# Altium project openbook.PrjPCB (part 4 of 4)

## Sheet p10_HDMI.SchDoc
size 386 x 246 mm
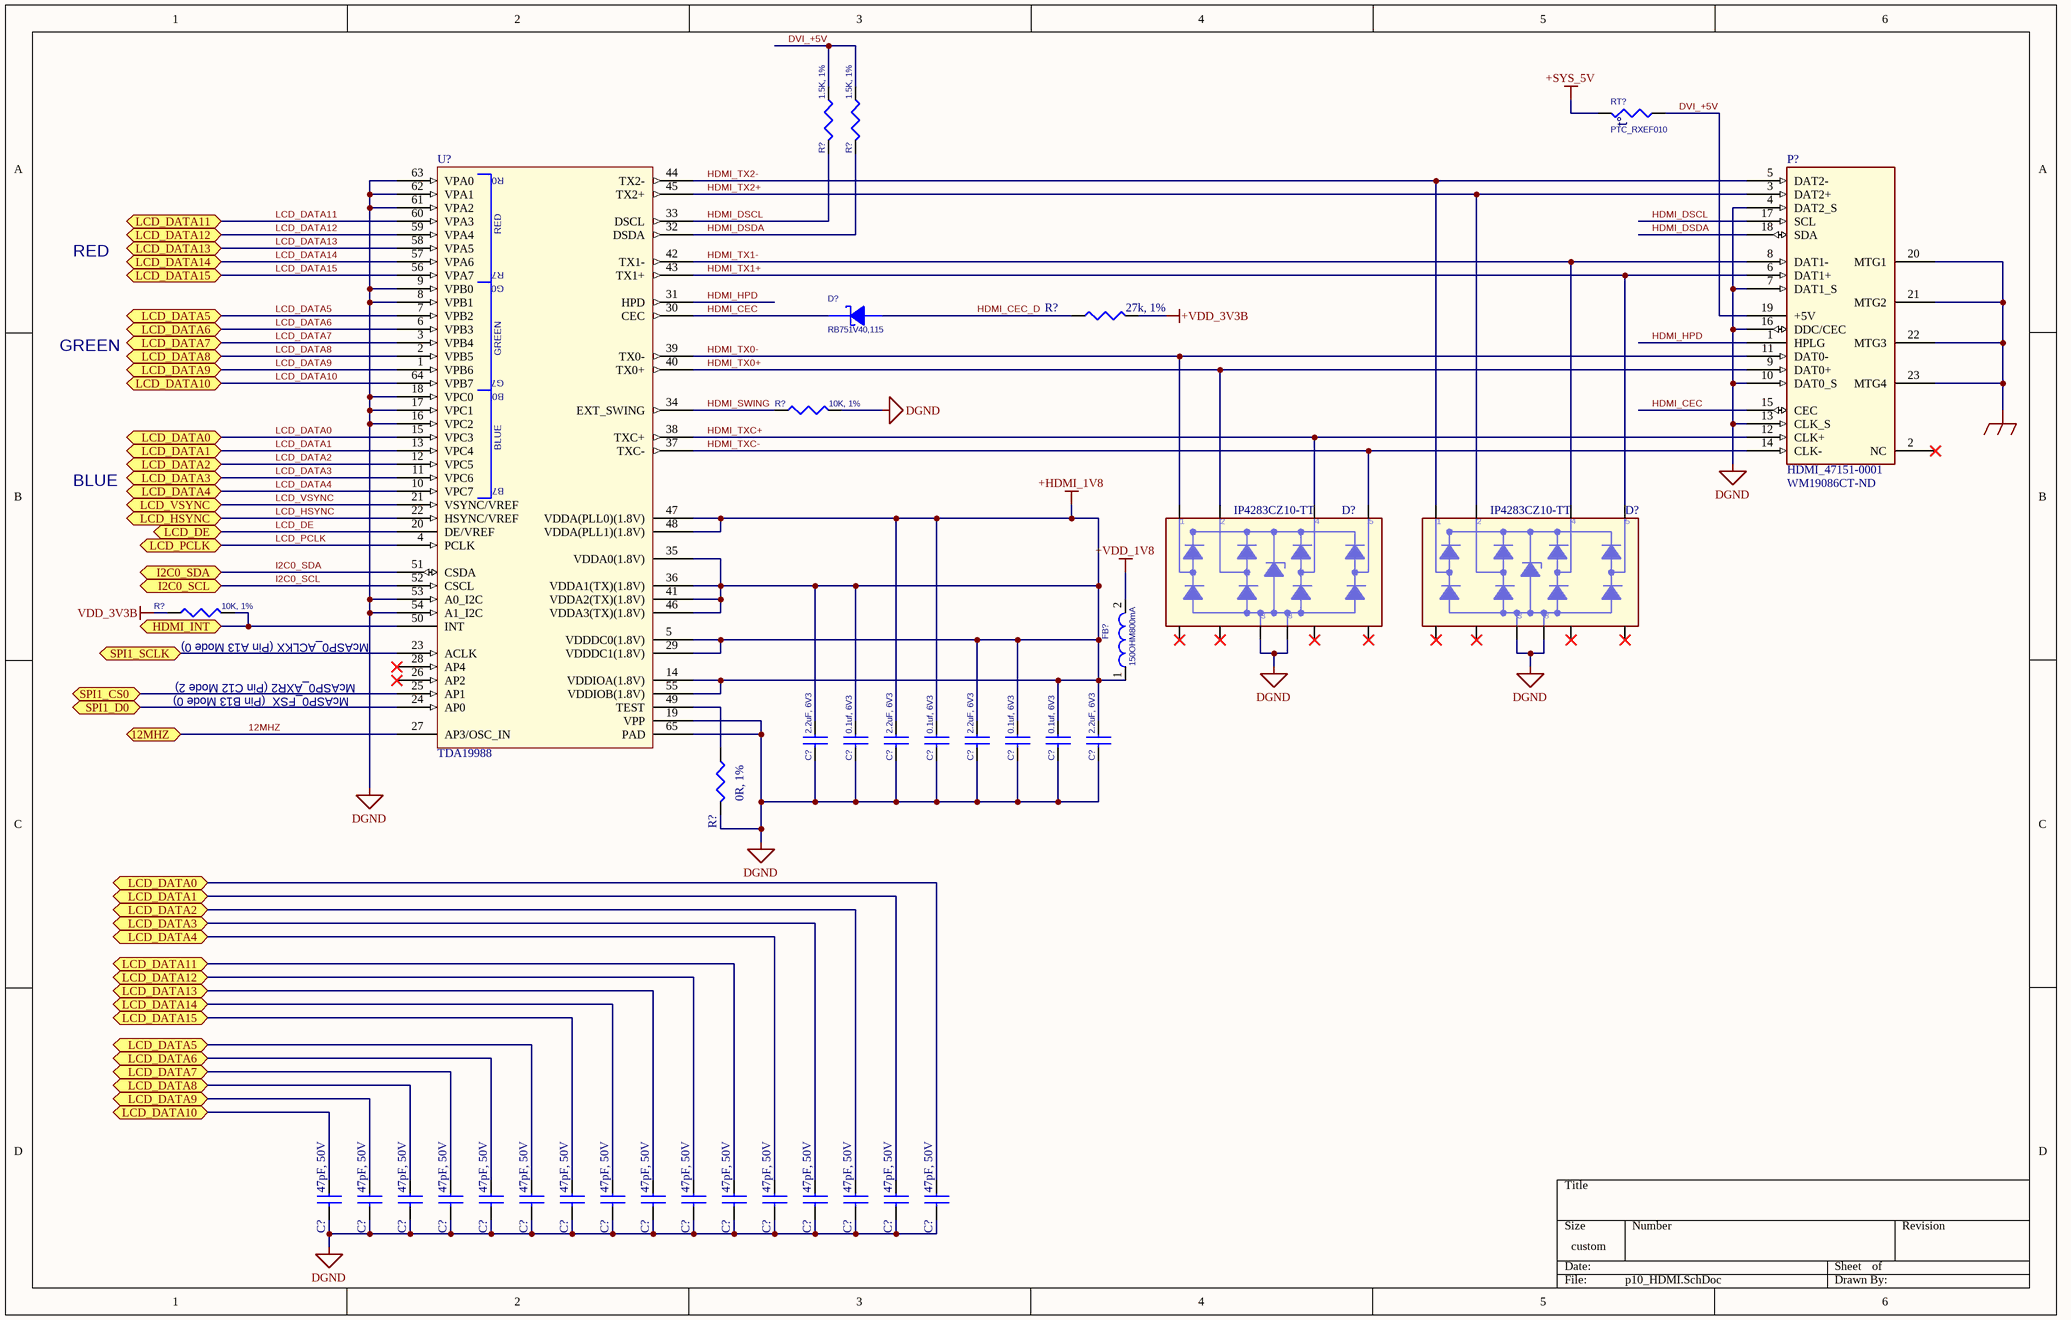
[diagram p10: p10_HDMI.SchDoc]

### Parts
(Parts that share a designator on the sheet are numbered #1, #2 ... from top to bottom, then left to right.)
C?#129  2.2uF, 6V3  [402]
C?#130  0.1uf, 6V3  [402]
C?#131  2.2uF, 6V3  [402]
C?#132  0.1uf, 6V3  [402]
C?#133  2.2uF, 6V3  [402]
C?#134  0.1uf, 6V3  [402]
C?#135  0.1uf, 6V3  [402]
C?#136  2.2uF, 6V3  [402]
C?#137  47pF, 50V  [402]
C?#138  47pF, 50V  [402]
C?#139  47pF, 50V  [402]
C?#140  47pF, 50V  [402]
C?#141  47pF, 50V  [402]
C?#142  47pF, 50V  [402]
C?#143  47pF, 50V  [402]
C?#144  47pF, 50V  [402]
C?#145  47pF, 50V  [402]
C?#146  47pF, 50V  [402]
C?#147  47pF, 50V  [402]
C?#148  47pF, 50V  [402]
C?#149  47pF, 50V  [402]
C?#150  47pF, 50V  [402]
C?#151  47pF, 50V  [402]
C?#152  47pF, 50V  [402]
D?#2  RB751V40,115  [SOD323]
D?#3  IP4283CZ10-TT  [TSSOP10]
D?#4  IP4283CZ10-TT  [TSSOP10]
FB?#8  150OHM800mA  [SM-7351-IND-0805]
P?#9  HDMI_47151-0001  Supplier Part Number 1: WM19086CT-ND  [HDMI]
R?#128  1.5K, 1%  [402]
R?#129  1.5K, 1%  [402]
R?#130  27k, 1%  [402]
R?#131  10K, 1%  [402]
R?#132  10K, 1%  [402]
R?#133  0R, 1%  [402]
RT?  PTC_RXEF010  [POLYSW200-5638-310]
U?#19  TDA19988  [QFN64S9X9P5]

### Ports
12MHZ, HDMI_INT, I2C0_SCL, I2C0_SDA, LCD_DATA0, LCD_DATA1, LCD_DATA2, LCD_DATA3, LCD_DATA4, LCD_DATA5, LCD_DATA6, LCD_DATA7, LCD_DATA8, LCD_DATA9, LCD_DATA10, LCD_DATA11, LCD_DATA12, LCD_DATA13, LCD_DATA14, LCD_DATA15, LCD_DE, LCD_HSYNC, LCD_PCLK, LCD_VSYNC, SPI1_CS0, SPI1_D0, SPI1_SCLK

### Nets
+HDMI_1V8: C?#129.1 C?#130.1 C?#131.1 C?#132.1 C?#133.1 C?#134.1 C?#135.1 C?#136.1 FB?#8.1 U?#19.5(VDDDC0(1.8V)) U?#19.14(VDDIOA(1.8V)) U?#19.29(VDDDC1(1.8V)) U?#19.35(VDDA0(1.8V)) U?#19.36(VDDA1(TX)(1.8V)) U?#19.41(VDDA2(TX)(1.8V)) U?#19.46(VDDA3(TX)(1.8V)) U?#19.47(VDDA(PLL0)(1.8V)) U?#19.48(VDDA(PLL1)(1.8V)) U?#19.55(VDDIOB(1.8V))
+SYS_5V: RT?.1(P1)
+VDD_1V8: FB?#8.2
+VDD_3V3B: R?#130.2
DGND: C?#129.2 C?#130.2 C?#131.2 C?#132.2 C?#133.2 C?#134.2 C?#135.2 C?#136.2 C?#137.2 C?#138.2 C?#139.2 C?#140.2 C?#141.2 C?#142.2 C?#143.2 C?#144.2 C?#145.2 C?#146.2 C?#147.2 C?#148.2 C?#149.2 C?#150.2 C?#151.2 C?#152.2 D?#3.3 D?#3.8 D?#4.3 D?#4.8 P?#9.4(DAT2_S) P?#9.7(DAT1_S) P?#9.10(DAT0_S) P?#9.13(CLK_S) P?#9.16(DDC/CEC) R?#131.2 R?#133.2 U?#19.8(VPB1) U?#19.9(VPB0) U?#19.16(VPC2) U?#19.17(VPC1) U?#19.18(VPC0) U?#19.19(VPP) U?#19.53(A0_I2C) U?#19.54(A1_I2C) U?#19.61(VPA2) U?#19.62(VPA1) U?#19.63(VPA0) U?#19.65(PAD)
GND_EARTH: P?#9.20(MTG1) P?#9.21(MTG2) P?#9.22(MTG3) P?#9.23(MTG4)
VDD_3V3B: R?#132.1
12MHZ: U?#19.27(AP3/OSC_IN) ; port 12MHZ
DVI_+5V: P?#9.19(+5V) R?#128.1 R?#129.1 RT?.2(P2)
HDMI_CEC: D?#2.1(C) P?#9.15(CEC) U?#19.30(CEC)
HDMI_CEC_D: D?#2.2(A) R?#130.1
HDMI_DSCL: P?#9.17(SCL) R?#128.2 U?#19.33(DSCL)
HDMI_DSDA: P?#9.18(SDA) R?#129.2 U?#19.32(DSDA)
HDMI_HPD: P?#9.1(HPLG) U?#19.31(HPD)
HDMI_SWING: R?#131.1 U?#19.34(EXT_SWING)
HDMI_TX0+: D?#3.2 P?#9.9(DAT0+) U?#19.40(TX0+)
HDMI_TX0-: D?#3.1 P?#9.11(DAT0-) U?#19.39(TX0-)
HDMI_TX1+: D?#4.5 P?#9.6(DAT1+) U?#19.43(TX1+)
HDMI_TX1-: D?#4.4 P?#9.8(DAT1-) U?#19.42(TX1-)
HDMI_TX2+: D?#4.2 P?#9.3(DAT2+) U?#19.45(TX2+)
HDMI_TX2-: D?#4.1 P?#9.5(DAT2-) U?#19.44(TX2-)
HDMI_TXC+: D?#3.4 P?#9.12(CLK+) U?#19.38(TXC+)
HDMI_TXC-: D?#3.5 P?#9.14(CLK-) U?#19.37(TXC-)
I2C0_SCL: U?#19.52(CSCL) ; port I2C0_SCL
I2C0_SDA: U?#19.51(CSDA) ; port I2C0_SDA  [project net I2C0_SCL]
LCD_DATA0: C?#152.1 U?#19.15(VPC3) ; port LCD_DATA0
LCD_DATA1: C?#151.1 U?#19.13(VPC4) ; port LCD_DATA1
LCD_DATA2: C?#150.1 U?#19.12(VPC5) ; port LCD_DATA2
LCD_DATA3: C?#149.1 U?#19.11(VPC6) ; port LCD_DATA3
LCD_DATA4: C?#148.1 U?#19.10(VPC7) ; port LCD_DATA4
LCD_DATA5: C?#142.1 U?#19.7(VPB2) ; port LCD_DATA5
LCD_DATA6: C?#141.1 U?#19.6(VPB3) ; port LCD_DATA6
LCD_DATA7: C?#140.1 U?#19.3(VPB4) ; port LCD_DATA7
LCD_DATA8: C?#139.1 U?#19.2(VPB5) ; port LCD_DATA8
LCD_DATA9: C?#138.1 U?#19.1(VPB6) ; port LCD_DATA9
LCD_DATA10: C?#137.1 U?#19.64(VPB7) ; port LCD_DATA10
LCD_DATA11: C?#147.1 U?#19.60(VPA3) ; port LCD_DATA11
LCD_DATA12: C?#146.1 U?#19.59(VPA4) ; port LCD_DATA12
LCD_DATA13: C?#145.1 U?#19.58(VPA5) ; port LCD_DATA13
LCD_DATA14: C?#144.1 U?#19.57(VPA6) ; port LCD_DATA14
LCD_DATA15: C?#143.1 U?#19.56(VPA7) ; port LCD_DATA15
LCD_DE: U?#19.20(DE/VREF) ; port LCD_DE
LCD_HSYNC: U?#19.22(HSYNC/VREF) ; port LCD_HSYNC
LCD_PCLK: U?#19.4(PCLK) ; port LCD_PCLK
LCD_VSYNC: U?#19.21(VSYNC/VREF) ; port LCD_VSYNC
SPI1_CS0: U?#19.25(AP1) ; port SPI1_CS0
SPI1_D0: U?#19.24(AP0) ; port SPI1_D0
SPI1_SCLK: U?#19.23(ACLK) ; port SPI1_SCLK
NetR?#132_2: R?#132.2 U?#19.50(INT) ; port HDMI_INT
NetR?#133_1: R?#133.1 U?#19.49(TEST)

Not connected (* = marked no-connect by the designer): D?#3 6* 7* 9* 10*; D?#4 6* 7* 9* 10*; P?#9 2(NC)*; U?#19 26(AP2)* 28(AP4)*

### Notes on the sheet
- RED
- GREEN
- BLUE
- (near R?#132) McASP0_ACLKX (Pin A13 Mode 0)
- McASP0_FSX  (Pin B13 Mode 0)
- McASP0_AXR2 (Pin C12 Mode 2)
- (in symbol PTC) t°
- (in symbol TDA19988) R0; RED; R7; G0; GREEN; G7; B0; BLUE; B7

### Library data of the parts
C?#129 C?#131 C?#133 C?#136 = CAP_2.2uF_X5R_6.3V_10%_0402: CAP CER 2.2UF 6.3V 10% X5R 0402; Manufacturer: TDK Corporation; Manufacturer Part Number: C1005X5R0J225K050BC; Capacitance: 2.2µF; Supplier 1: Digi-Key; Supplier Part Number 1: 445-6847-6-ND; RoHS: RoHS Compliant; Category: Capacitors; Stock 1: 47221; Pricing 1: 1=0.24, 10=0.2, 100=0.1, 250=0.075, 500=0.06626, 1000=0.05875, 5000=0.04875 (USD); Voltage - Rated: 6.3V; Tolerance: ±10%; Temperature Coefficient: X5R; Mounting Type: Surface Mount, MLCC; Operating Temperature: -55°C ~ 85°C; Applications: General Purpose; Ratings: -; Package / Case: 0402 (1005 Metric); Size / Dimension: 0.039" L x 0.020" W (1.00mm x 0.50mm); Height - Seated (Max): -; Thickness (Max): 0.022" (0.55mm); Lead Spacing: -; Features: -; Packaging: Digi-Reel®; Lead Style: -; ComponentLink1URL: http://product.tdk.com/capacitor/mlcc/en/documents/mlcc_commercial_general_en.pdf; ComponentLink1Description: http://product.tdk.com/capacitor/mlcc/en/documents/mlcc_commercial_general_en.pdf
C?#130 C?#132 C?#134 C?#135 = CAP_0.1uF_X7R_16V_10% 0402: CAP CER 0.1UF 6.3V 10% X5R 0402; Manufacturer: TDK Corporation; Manufacturer Part Number: C1005X5R0J104K050BA; Capacitance: 0.1µF; Applications: General Purpose; Category: Capacitors; ComponentLink1Description: http://www.kemet.com/datasheets&C0402C104K4RACTU; ComponentLink1URL: http://www.kemet.com/datasheets&C0402C104K4RACTU; Features: -; Height - Seated (Max): -; Lead Spacing: -; Lead Style: -; Mounting Type: Surface Mount, MLCC; Operating Temperature: -55°C ~ 85°C; Package / Case: 0402 (1005 Metric); Packaging: Digi-Reel®; Pricing 1: 1=0.1, 10=0.026, 100=0.0121, 250=0.00992, 500=0.00848, 1000=0.0066, 5000=0.0055 (USD); Ratings: -; RoHS: RoHS Compliant; Size / Dimension: 0.039" L x 0.020" W (1.00mm x 0.50mm); Stock 1: 127604; Supplier 1: Digi-Key; Supplier Part Number 1: 445-1266-6-ND; Temperature Coefficient: X5R; Thickness (Max): 0.022" (0.55mm); Tolerance: ±10%; Voltage - Rated: 6.3V
C?#137-C?#152 = CAP_47PF_COG_50V_5%_0402: CAP CER 47PF 50V 5% NP0 0402; Manufacturer: TDK Corporation; Manufacturer Part Number: C1005C0G1H470J050BA; Temperature Coefficient: C0G, NP0; Supplier 1: Digi-Key; RoHS: RoHS Compliant; Category: Capacitors; Stock 1: 596222; Pricing 1: 1=0.1, 10=0.024, 100=0.011, 250=0.009, 500=0.0077, 1000=0.006, 5000=0.005 (USD); Packaging: Cut Tape (CT); Capacitance: 47pF; Voltage - Rated: 50V; Tolerance: ±5%; Mounting Type: Surface Mount, MLCC; Operating Temperature: -55°C ~ 125°C; Applications: General Purpose; Ratings: -; Package/Case: 0402 (1005 Metric); Size / Dimension: 0.039" L x 0.020" W (1.00mm x 0.50mm); Height - Seated (Max): -; Thickness (Max): 0.022" (0.55mm); Lead Spacing: -; Features: -; Lead Style: -; ComponentLink1URL: http://product.tdk.com/capacitor/mlcc/en/documents/mlcc_commercial_general_en.pdf; ComponentLink1Description: http://product.tdk.com/capacitor/mlcc/en/documents/mlcc_commercial_general_en.pdf; Supplier Part Number 1: 445-1243-1-ND
D?#2 = Zener: DIODE SCHOTTKY 40V 120MA SOD323; Manufacturer: NXP Semiconductors; Current - Average Rectified (Io): 120mA (DC); Voltage - Forward (Vf) (Max) @ If: 370mV @ 1mA; Speed: Small Signal =< 200mA (Io), Any Speed; Current - Reverse Leakage @ Vr: 500nA @ 30V; Capacitance @ Vr, F: 2pF @ 1V, 1MHz; Supplier 1: Digi-Key; Supplier Part Number 1: 568-8119-6-ND; Manufacturer Part Number: RB751V40,115; RoHS: RoHS Compliant; Category: Discrete Semiconductor Products; Stock 1: 5326; Pricing 1: 1=0.29, 10=0.26, 25=0.1872, 100=0.1456, 250=0.09152, 500=0.07798, 1000=0.05313 (USD); Diode Type: Schottky; Voltage - DC Reverse (Vr) (Max): 40V; Reverse Recovery Time (trr): -; Mounting Type: Surface Mount; Package / Case: SC-76, SOD-323; Supplier Device Package: SOD-323; Packaging: Digi-Reel®; ComponentLink1URL: http://www.nxp.com/documents/data_sheet/RB751_SER.pdf; ComponentLink1Description: http://www.nxp.com/documents/data_sheet/RB751_SER.pdf
D?#3 D?#4 = 32CTQ030/TO_1: DIODE ESD PROT HDMI 10TSSOP; Manufacturer: NXP Semiconductors; Manufacturer Part Number: IP4283CZ10-TT,118; Voltage - Reverse Standoff (Typ): 3V; Voltage - Breakdown: 6V; Polarization: 4 Channel Array - Unidirectional; Supplier 1: Digi-Key; Supplier Part Number 1: 568-5875-6-ND; RoHS: RoHS Compliant; Category: Circuit Protection; Stock 1: 1067; Pricing 1: 1=0.85, 10=0.743, 25=0.6568, 100=0.5724, 250=0.49828, 500=0.42416, 1000=0.33974 (USD); Power (Watts): -; Mounting Type: Surface Mount; Package / Case: 10-TFSOP, 10-MSOP (0.118", 3.00mm Width); Supplier Device Package: 10-TSSOP; Packaging: Digi-Reel®; ComponentLink1URL: http://media.digikey.com/pdf/Data%20Sheets/NXP%20PDFs/IP4283CZ10.pdf; ComponentLink1Description: http://media.digikey.com/pdf/Data%20Sheets/NXP%20PDFs/IP4283CZ10.pdf
FB?#8 = IND: FERRITE 800MA 150 OHM 0805 SMD; Manufacturer: Laird-Signal Integrity Products; Manufacturer Part Number: LI0805H151R-10; Impedance @ Frequency: 150 Ohm @ 100MHz; DC Resistance (DCR): 150 mOhm Max; Filter Type: Differential Mode - Single; Supplier 1: Digi-Key; Supplier Part Number 1: 240-2384-6-ND; RoHS: RoHS Compliant; Category: Filters; Stock 1: 10144; Pricing 1: 1=0.1, 10=0.07, 25=0.064, 50=0.0574, 100=0.0421, 250=0.03064, 500=0.02808, 1000=0.02424 (USD); Current Rating: 800mA; Package / Case: 0805 (2012 Metric); Mounting Type: Surface Mount; Packaging: Digi-Reel®; Height (Max): 0.043" (1.10mm); Size / Dimension: 0.079" L x 0.049" W (2.00mm x 1.25mm); ComponentLink1URL: http://www.lairdtech.com/WorkArea/linkit.aspx?LinkIdentifier=id&ItemID=4912; ComponentLink1Description: http://www.lairdtech.com/WorkArea/linkit.aspx?LinkIdentifier=id&ItemID=4912
P?#9 = HDMI_47151-0001: CONN RCPT 19POS HDMI RT ANG SMD; Manufacturer: Molex Inc; Manufacturer Part Number: 0471510001; Number of Contacts: 19; Gender: Receptacle; Supplier 1: Digi-Key; RoHS: RoHS Compliant; Category: Connectors, Interconnects; Stock 1: 6388; Pricing 1: 1=2.57, 10=2.332, 25=2.1888, 50=2.0938, 100=1.9986 (USD); Packaging: Cut Tape (CT); Connector Type: HDMI; Specifications: -; Mounting Type: Surface Mount, Right Angle, Horizontal; Features: Detent Lock; Ingress Protection: -; ComponentLink1URL: http://www.molex.com/pdm_docs/sd/471510001_sd.pdf; ComponentLink1Description: http://www.molex.com/pdm_docs/sd/471510001_sd.pdf
R?#128 R?#129 = RES_1.5K_1/16W_5%_0402: RES 1.50K OHM 1/16W 1% 0402 SMD; Manufacturer: Yageo; Manufacturer Part Number: RC0402FR-071K5L; Power (Watts): 0.063W, 1/16W; Temperature Coefficient: ±100ppm/°C; Supplier 1: Digi-Key; Supplier Part Number 1: 311-1.50KLRDKR-ND; RoHS: RoHS Compliant; Category: Resistors; Stock 1: 465266; Pricing 1: 1=0.1, 10=0.014, 25=0.0104, 100=0.0063, 250=0.0054, 500=0.00382, 1000=0.0027, 2500=0.00234, 5000=0.00203 (USD); Resistance (Ohms): 1.5k; Composition: Thick Film; Features: -; Tolerance: ±1%; Package / Case: 0402 (1005 Metric); Supplier Device Package: 0402; Size / Dimension: 0.039" L x 0.020" W (1.00mm x 0.50mm); Height: 0.016" (0.40mm); Number of Terminations: 2; Packaging: Digi-Reel®; ComponentLink1URL: http://www.yageo.com/documents/recent/PYu-RC0402_51_RoHS_L_6.pdf; ComponentLink1Description: http://www.yageo.com/documents/recent/PYu-RC0402_51_RoHS_L_6.pdf
R?#130 = RES_27K_1/16W_1%_0402: RES 27K OHM 1/16W 1% 0402 SMD; Manufacturer: Yageo; Manufacturer Part Number: RC0402FR-0727KL; Power (Watts): 0.063W, 1/16W; Temperature Coefficient: ±100ppm/°C; Supplier 1: Digi-Key; RoHS: RoHS Compliant; Category: Resistors; Stock 1: 270424; Pricing 1: 1=0.1, 10=0.014, 25=0.0104, 100=0.0063, 250=0.0054, 500=0.00382, 1000=0.0027, 2500=0.00234, 5000=0.00203 (USD); Packaging: Cut Tape (CT); Resistance (Ohms): 27k; Tolerance: ±1%; Composition: Thick Film; Features: -; Package/Case: 0402 (1005 Metric); Supplier Device Package: 0402; Size / Dimension: 0.039" L x 0.020" W (1.00mm x 0.50mm); Height: 0.016" (0.40mm); Number of Terminations: 2; ComponentLink1URL: http://www.yageo.com/documents/recent/PYu-RC0402_51_RoHS_L_6.pdf; ComponentLink1Description: http://www.yageo.com/documents/recent/PYu-RC0402_51_RoHS_L_6.pdf; Supplier Part Number 1: 311-27.0KLRCT-ND
R?#131 R?#132 = RES_10K_1/16W_1%_0402: RES 10K OHM 1/16W 5% 0402 SMD; Manufacturer: Rohm Semiconductor; Manufacturer Part Number: MCR01MZPJ103; Power (Watts): 0.063W, 1/16W; Temperature Coefficient: ±200ppm/°C; Supplier 1: Digi-Key; Supplier Part Number 1: RHM10KJDKR-ND; RoHS: RoHS Compliant; Category: Resistors; Stock 1: 110842; Pricing 1: 1=0.1, 10=0.019, 25=0.014, 100=0.0078, 250=0.00596, 500=0.00476, 1000=0.0035, 5000=0.00251 (USD); Resistance (Ohms): 10k; Composition: Thick Film; Features: Automotive AEC-Q200 Qualified; Tolerance: ±5%; Package / Case: 0402 (1005 Metric); Supplier Device Package: 0402 (1005 Metric); Size / Dimension: 0.039" L x 0.020" W (1.00mm x 0.50mm); Height: 0.016" (0.40mm); Number of Terminations: 2; Packaging: Digi-Reel®; ComponentLink1URL: http://rohmfs.rohm.com/en/products/databook/datasheet/passive/resistor/chip_resistor/mcr_a.pdf; ComponentLink1Description: http://rohmfs.rohm.com/en/products/databook/datasheet/passive/resistor/chip_resistor/mcr_a.pdf
R?#133 = RES_0_1/16W_1%_0402: RES 0.0 OHM 1/16W 0402 SMD; Manufacturer: Yageo; Manufacturer Part Number: RC0402JR-070RL; Power (Watts): 0.063W, 1/16W; Resistance (Ohms): 0.0; Tolerance: Jumper; Category: Resistors; ComponentLink1Description: http://www.yageo.com/documents/recent/PYu-RC0402_51_RoHS_L_6.pdf; ComponentLink1URL: http://www.yageo.com/documents/recent/PYu-RC0402_51_RoHS_L_6.pdf; Composition: Thick Film; Features: -; Height: 0.016" (0.40mm); Number of Terminations: 2; Package / Case: 0402 (1005 Metric); Packaging: Digi-Reel®; Pricing 1: 1=0.1, 10=0.012, 25=0.0092, 100=0.0055, 250=0.00476, 500=0.00336, 1000=0.00237, 2500=0.00206, 5000=0.00178 (USD); RoHS: RoHS Compliant; Size / Dimension: 0.039" L x 0.020" W (1.00mm x 0.50mm); Stock 1: 4904429; Supplier 1: Digi-Key; Supplier Device Package: 0402; Supplier Part Number 1: 311-0.0JRDKR-ND; Temperature Coefficient: -
RT? = PTC: POLYSWITCH PTC RESET 0.1A; Manufacturer: TE Connectivity; Current - Hold (Ih) (Max): 100mA; Current - Trip (It): 200mA; Current - Max: 40A; Voltage - Max: 60V; R Min/Max: 2.500 ~ 4.500 Ohm; Time to Trip: 4s; Supplier 1: Digi-Key; Supplier Part Number 1: RXEF010-ND; Manufacturer Part Number: RXEF010; RoHS: RoHS Compliant; Category: Circuit Protection; Stock 1: 22325; Pricing 1: 1=0.32, 10=0.289, 100=0.2625, 500=0.20476, 1000=0.1764, 5000=0.1617, 10000=0.1365, 50000=0.13125, 100000=0.126 (USD); Package / Case: Radial, Disc; Packaging: Bulk; ComponentLink1URL: http://documents.tycoelectronics.com/commerce/DocumentDelivery/DDEController?Action=showdoc&DocId=Specification+Or+Standard%7FSCD25213%7FE%7Fpdf%7FEnglish%7FENG_SS_SCD25213_E.pdf; ComponentLink1Description: http://documents.tycoelectronics.com/commerce/DocumentDelivery/DDEController?Action=showdoc&DocId=Specification+Or+Standard%7FSCD25213%7FE%7Fpdf%7FEnglish%7FENG_SS_SCD25213_E.pdf
U?#19 = TDA19988: IC HDMI TRANSMITTER 64-HVQFN; Manufacturer: NXP Semiconductors; Manufacturer Part Number: TDA19988AHN/C1,551; Supplier 1: Digi-Key; Supplier Part Number 1: TDA19988AHN/C1,551-ND; RoHS: RoHS Compliant; Category: Integrated Circuits (ICs); Stock 1: 0; Pricing 1: 260=4.59 (USD); Type: HDMI Transmitter; Applications: Set-Top Boxes; Mounting Type: Surface Mount; Package / Case: 64-VFQFN Exposed Pad; Supplier Device Package: 64-HVQFN (9x9); Packaging: Tray

## Sheet p11_LVDS.SchDoc
size 386 x 246 mm
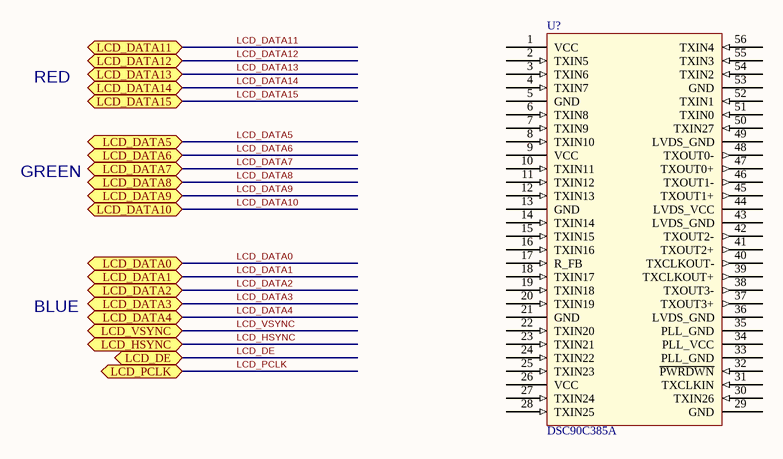
[diagram p11: p11_LVDS.SchDoc]

### Parts
(Parts that share a designator on the sheet are numbered #1, #2 ... from top to bottom, then left to right.)
U?#20  DSC90C385A  [TSSOP56]

### Ports
LCD_DATA0, LCD_DATA1, LCD_DATA2, LCD_DATA3, LCD_DATA4, LCD_DATA5, LCD_DATA6, LCD_DATA7, LCD_DATA8, LCD_DATA9, LCD_DATA10, LCD_DATA11, LCD_DATA12, LCD_DATA13, LCD_DATA14, LCD_DATA15, LCD_DE, LCD_HSYNC, LCD_PCLK, LCD_VSYNC

### Nets

Not connected (* = marked no-connect by the designer): U?#20 1(VCC) 2(TXIN5) 3(TXIN6) 4(TXIN7) 5(GND) 6(TXIN8) 7(TXIN9) 8(TXIN10) 9(VCC) 10(TXIN11) 11(TXIN12) 12(TXIN13) 13(GND) 14(TXIN14) 15(TXIN15) 16(TXIN16) 17(R_FB) 18(TXIN17) 19(TXIN18) 20(TXIN19) 21(GND) 22(TXIN20) 23(TXIN21) 24(TXIN22) 25(TXIN23) 26(VCC) 27(TXIN24) 28(TXIN25) 29(GND) 30(TXIN26) 31(TXCLKIN) 32(~{PWRDWN}) 33(PLL_GND) 34(PLL_VCC) 35(PLL_GND) 36(LVDS_GND) 37(TXOUT3+) 38(TXOUT3-) 39(TXCLKOUT+) 40(TXCLKOUT-) 41(TXOUT2+) 42(TXOUT2-) 43(LVDS_GND) 44(LVDS_VCC) 45(TXOUT1+) 46(TXOUT1-) 47(TXOUT0+) 48(TXOUT0-) 49(LVDS_GND) 50(TXIN27) 51(TXIN0) 52(TXIN1) 53(GND) 54(TXIN2) 55(TXIN3) 56(TXIN4)

### Notes on the sheet
- RED
- GREEN
- BLUE

### Library data of the parts
U?#20 = DS90C385A: IC TX LVDS FPD 24BIT 56TSSOP; Manufacturer: Texas Instruments; Manufacturer Part Number: DS90C385AMTX/NOPB; Protocol: FPD-Link, LVDS; Number of Drivers/Receivers: 5/0; Data Rate: 2.45Gbps; Voltage - Supply: 3 V ~ 3.6 V; Supplier 1: Digi-Key; RoHS: RoHS Compliant; Category: Integrated Circuits (ICs); Stock 1: 2071; Pricing 1: 1=4.92, 10=4.412, 25=3.9672, 100=2.3085, 250=2.26576, 500=2.223 (USD); Packaging: Cut Tape (CT); Type: Driver; Duplex: -; Receiver Hysteresis: -; Operating Temperature: -10°C ~ 70°C; Mounting Type: Surface Mount; Package / Case: 56-TFSOP (0.240", 6.10mm Width); Supplier Device Package: 56-TSSOP; ComponentLink1URL: http://www.ti.com/lit/ds/symlink/ds90c385a.pdf; ComponentLink1Description: http://www.ti.com/lit/ds/symlink/ds90c385a.pdf; Supplier Part Number 1: DS90C385AMTX/NOPBCT-ND

## Sheet p12_trackpad_keyboard.SchDoc
size A

## Sheet p13_SD.SchDoc
size 386 x 246 mm
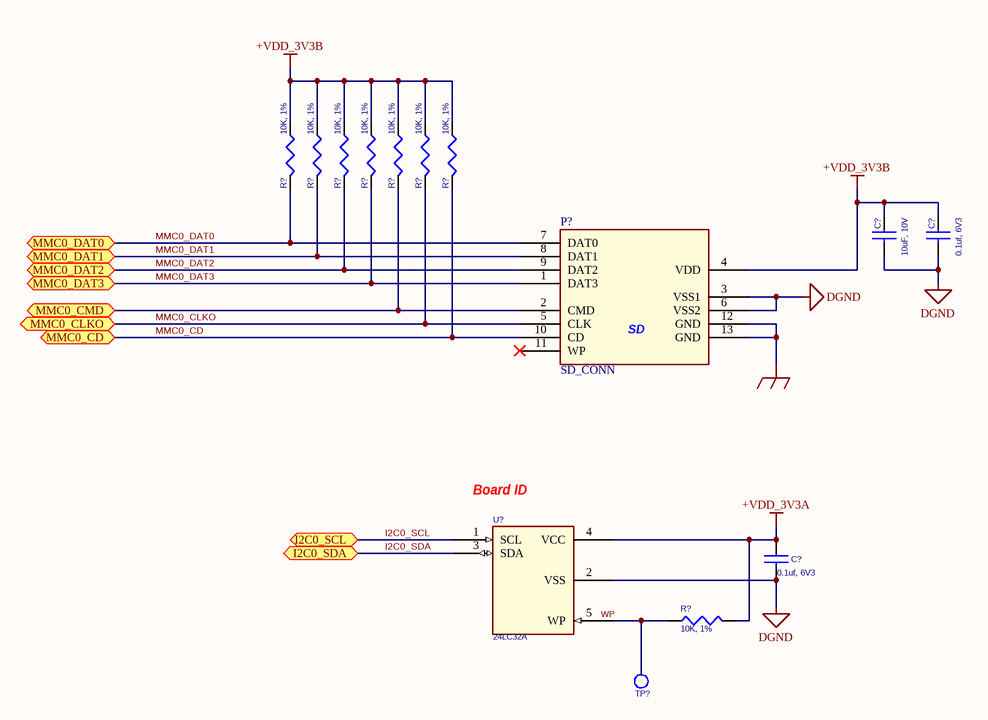
[diagram p12: p13_SD.SchDoc]

### Parts
(Parts that share a designator on the sheet are numbered #1, #2 ... from top to bottom, then left to right.)
C?#153  10uF, 10V  [805]
C?#154  0.1uf, 6V3  [402]
C?#155  0.1uf, 6V3  [402]
P?#10  SD_CONN  [SD-CONN]
R?#134  10K, 1%  [402]
R?#135  10K, 1%  [402]
R?#136  10K, 1%  [402]
R?#137  10K, 1%  [402]
R?#138  10K, 1%  [402]
R?#139  10K, 1%  [402]
R?#140  10K, 1%  [402]
R?#141  10K, 1%  [402]
TP?  TESTPT1  [tp1-8040]  (value not drawn)  (no BOM)
U?#21  24LC32A  [SOT23-5]

### Ports
I2C0_SCL, I2C0_SDA, MMC0_CD, MMC0_CLKO, MMC0_CMD, MMC0_DAT0, MMC0_DAT1, MMC0_DAT2, MMC0_DAT3

### Nets
+VDD_3V3A: C?#155.1 R?#141.2 U?#21.4(VCC)
+VDD_3V3B: C?#153.1 C?#154.1 P?#10.4(VDD) R?#134.1 R?#135.1 R?#136.1 R?#137.1 R?#138.1 R?#139.1 R?#140.1
DGND: C?#153.2 C?#154.2 C?#155.2 P?#10.3(VSS1) P?#10.6(VSS2) U?#21.2(VSS)
GND_EARTH: P?#10.12(GND) P?#10.13(GND)
I2C0_SCL: U?#21.1(SCL) ; port I2C0_SCL
I2C0_SDA: U?#21.3(SDA) ; port I2C0_SDA  [project net I2C0_SCL]
MMC0_CD: P?#10.10(CD) R?#140.2 ; port MMC0_CD
MMC0_CLKO: P?#10.5(CLK) R?#139.2 ; port MMC0_CLKO
MMC0_CMD: P?#10.2(CMD) R?#138.2 ; port MMC0_CMD
MMC0_DAT0: P?#10.7(DAT0) R?#134.2 ; port MMC0_DAT0
MMC0_DAT1: P?#10.8(DAT1) R?#135.2 ; port MMC0_DAT1
MMC0_DAT2: P?#10.9(DAT2) R?#136.2 ; port MMC0_DAT2
MMC0_DAT3: P?#10.1(DAT3) R?#137.2 ; port MMC0_DAT3
NetR?#141_1: R?#141.1 U?#21.5(WP)

Not connected (* = marked no-connect by the designer): P?#10 11(WP)*; TP? 1(TP)

### Notes on the sheet
- (near U?#21) Board ID
- Labels drawn without touching a wire or pin: WP
- (in symbol SD_CONN) SD

### Library data of the parts
C?#153 = CAP_10uF_Y5V_10V_10%_0805: CAP CER 10UF 10V Y5V 0805; Manufacturer: TDK Corporation; Manufacturer Part Number: C2012Y5V1A106Z; Capacitance: 10µF; Tolerance: -20%, +80%; Temperature Coefficient: Y5V (F); Supplier 1: Digi-Key; Supplier Part Number 1: 445-1371-6-ND; RoHS: RoHS Compliant; Category: Capacitors; Stock 1: 123307; Pricing 1: 1=0.15, 10=0.105, 100=0.0499, 250=0.042, 500=0.03518, 1000=0.02887 (USD); Voltage - Rated: 10V; Mounting Type: Surface Mount, MLCC; Operating Temperature: -30°C ~ 85°C; Applications: General Purpose; Ratings: -; Package / Case: 0805 (2012 Metric); Size / Dimension: 0.079" L x 0.049" W (2.00mm x 1.25mm); Height - Seated (Max): -; Thickness (Max): 0.057" (1.45mm); Lead Spacing: -; Features: -; Packaging: Digi-Reel®; Lead Style: -; ComponentLink1URL: http://media.digikey.com/pdf/Data%20Sheets/TDK%20PDFs/C_Series_GeneralAppl_B11.pdf; ComponentLink1Description: http://media.digikey.com/pdf/Data%20Sheets/TDK%20PDFs/C_Series_GeneralAppl_B11.pdf
C?#154 C?#155 = CAP_0.1uF_X7R_16V_10% 0402: as C?#130 on sheet p10_HDMI; Applications: General Purpose; Category: Capacitors; ComponentLink1Description: http://www.kemet.com/datasheets&C0402C104K4RACTU; ComponentLink1URL: http://www.kemet.com/datasheets&C0402C104K4RACTU; Features: -; Height - Seated (Max): -; Lead Spacing: -; Lead Style: -; Mounting Type: Surface Mount, MLCC; Operating Temperature: -55°C ~ 85°C; Package / Case: 0402 (1005 Metric); Packaging: Digi-Reel®; Pricing 1: 1=0.1, 10=0.026, 100=0.0121, 250=0.00992, 500=0.00848, 1000=0.0066, 5000=0.0055 (USD); Ratings: -; RoHS: RoHS Compliant; Size / Dimension: 0.039" L x 0.020" W (1.00mm x 0.50mm); Stock 1: 127604; Supplier 1: Digi-Key; Supplier Part Number 1: 445-1266-6-ND; Temperature Coefficient: X5R; Thickness (Max): 0.022" (0.55mm); Tolerance: ±10%; Voltage - Rated: 6.3V
P?#10 = SD_CONN: CONNECTOR SD 9POS PUSH PUSH; Manufacturer: Amphenol Commercial Products; Manufacturer Part Number: 101-00313-68-02; Card Type: Secure Digital - SD; Number of Positions: 9; Connector Type: Connector and Ejector; Insertion, Removal Method: Push In, Push Out; Supplier 1: Digi-Key; RoHS: RoHS Compliant; Category: Connectors, Interconnects; Stock 1: 8816; Pricing 1: 1=2.19, 10=1.989, 25=1.8672, 50=1.786, 100=1.7048 (USD); Packaging: Cut Tape (CT); Ejector Side: -; Mounting Type: Surface Mount, Right Angle; Features: Board Guide; Height Above Board: 0.106" (2.70mm); Mounting Feature: Normal, Standard - Top; Contact Finish: Gold; Contact Finish Thickness: 15µin (0.38µm); ComponentLink1URL: http://media.digikey.com/pdf/Data%20Sheets/Amphenol%20PDFs/101-00313.pdf; ComponentLink1Description: http://media.digikey.com/pdf/Data%20Sheets/Amphenol%20PDFs/101-00313.pdf; Supplier Part Number 1: 101-00313-68-02CT-ND
R?#134-R?#141 = RES_10K_1/16W_1%_0402: as R?#131 on sheet p10_HDMI; Supplier 1: Digi-Key; Supplier Part Number 1: RHM10KJDKR-ND; RoHS: RoHS Compliant; Category: Resistors; Stock 1: 110842; Pricing 1: 1=0.1, 10=0.019, 25=0.014, 100=0.0078, 250=0.00596, 500=0.00476, 1000=0.0035, 5000=0.00251 (USD); Resistance (Ohms): 10k; Composition: Thick Film; Features: Automotive AEC-Q200 Qualified; Tolerance: ±5%; Package / Case: 0402 (1005 Metric); Supplier Device Package: 0402 (1005 Metric); Size / Dimension: 0.039" L x 0.020" W (1.00mm x 0.50mm); Height: 0.016" (0.40mm); Number of Terminations: 2; Packaging: Digi-Reel®; ComponentLink1URL: http://rohmfs.rohm.com/en/products/databook/datasheet/passive/resistor/chip_resistor/mcr_a.pdf; ComponentLink1Description: http://rohmfs.rohm.com/en/products/databook/datasheet/passive/resistor/chip_resistor/mcr_a.pdf
U?#21 = 24LC32A: IC EEPROM 32KBIT 400KHZ SOT23-5; Manufacturer: Microchip Technology; Manufacturer Part Number: 24LC32AT-I/OT; Format - Memory: EEPROMs - Serial; Memory Size: 32K (4K x 8); Interface: I²C, 2-Wire Serial; Voltage - Supply: 2.5 V ~ 5.5 V; Supplier 1: Digi-Key; Supplier Part Number 1: 24LC32AT-I/OTDKR-ND; RoHS: RoHS Compliant; Category: Integrated Circuits (ICs); Stock 1: 8694; Pricing 1: 1=0.5, 10=0.32, 25=0.31, 100=0.3 (USD); Memory Type: EEPROM; Speed: 400kHz; Operating Temperature: -40°C ~ 85°C; Package / Case: SC-74A, SOT-753; Supplier Device Package: SOT-23-5; Packaging: Digi-Reel®; ComponentLink1URL: http://ww1.microchip.com/downloads/en/DeviceDoc/21713M.pdf; ComponentLink1Description: http://ww1.microchip.com/downloads/en/DeviceDoc/21713M.pdf

## Sheet p14_WiFi_RAK310.SchDoc
size 386 x 246 mm
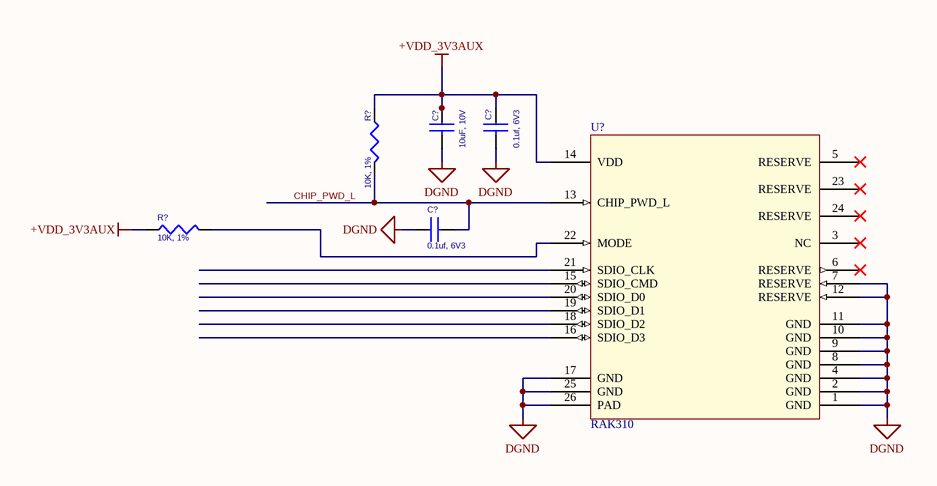
[diagram p13: p14_WiFi_RAK310.SchDoc]

### Parts
(Parts that share a designator on the sheet are numbered #1, #2 ... from top to bottom, then left to right.)
C?#156  10uF, 10V  [805]
C?#157  0.1uf, 6V3  [402]
C?#158  0.1uf, 6V3  [402]
R?#142  10K, 1%  [402]
R?#143  10K, 1%  [402]
U?#22  RAK310  [RAK310_MOD]

### Nets
+VDD_3V3AUX: C?#156.1 C?#157.1 R?#142.1 R?#143.1 U?#22.14(VDD)
DGND: C?#156.2 C?#157.2 C?#158.1 U?#22.1(GND) U?#22.2(GND) U?#22.4(GND) U?#22.7(RESERVE) U?#22.8(GND) U?#22.9(GND) U?#22.10(GND) U?#22.11(GND) U?#22.12(RESERVE) U?#22.17(GND) U?#22.25(GND) U?#22.26(PAD)
CHIP_PWD_L: C?#158.2 R?#142.2 U?#22.13(CHIP_PWD_L)
NetR?#143_2: R?#143.2 U?#22.22(MODE)

Not connected (* = marked no-connect by the designer): U?#22 3(NC)* 5(RESERVE)* 6(RESERVE)* 15(SDIO_CMD) 16(SDIO_D3) 18(SDIO_D2) 19(SDIO_D1) 20(SDIO_D0) 21(SDIO_CLK) 23(RESERVE)* 24(RESERVE)*

### Library data of the parts
C?#156 = CAP_10uF_Y5V_10V_10%_0805: as C?#153 on sheet p13_SD; Supplier 1: Digi-Key; Supplier Part Number 1: 445-1371-6-ND; RoHS: RoHS Compliant; Category: Capacitors; Stock 1: 123307; Pricing 1: 1=0.15, 10=0.105, 100=0.0499, 250=0.042, 500=0.03518, 1000=0.02887 (USD); Voltage - Rated: 10V; Mounting Type: Surface Mount, MLCC; Operating Temperature: -30°C ~ 85°C; Applications: General Purpose; Ratings: -; Package / Case: 0805 (2012 Metric); Size / Dimension: 0.079" L x 0.049" W (2.00mm x 1.25mm); Height - Seated (Max): -; Thickness (Max): 0.057" (1.45mm); Lead Spacing: -; Features: -; Packaging: Digi-Reel®; Lead Style: -; ComponentLink1URL: http://media.digikey.com/pdf/Data%20Sheets/TDK%20PDFs/C_Series_GeneralAppl_B11.pdf; ComponentLink1Description: http://media.digikey.com/pdf/Data%20Sheets/TDK%20PDFs/C_Series_GeneralAppl_B11.pdf
C?#157 C?#158 = CAP_0.1uF_X7R_16V_10% 0402: as C?#130 on sheet p10_HDMI; Applications: General Purpose; Category: Capacitors; ComponentLink1Description: http://www.kemet.com/datasheets&C0402C104K4RACTU; ComponentLink1URL: http://www.kemet.com/datasheets&C0402C104K4RACTU; Features: -; Height - Seated (Max): -; Lead Spacing: -; Lead Style: -; Mounting Type: Surface Mount, MLCC; Operating Temperature: -55°C ~ 85°C; Package / Case: 0402 (1005 Metric); Packaging: Digi-Reel®; Pricing 1: 1=0.1, 10=0.026, 100=0.0121, 250=0.00992, 500=0.00848, 1000=0.0066, 5000=0.0055 (USD); Ratings: -; RoHS: RoHS Compliant; Size / Dimension: 0.039" L x 0.020" W (1.00mm x 0.50mm); Stock 1: 127604; Supplier 1: Digi-Key; Supplier Part Number 1: 445-1266-6-ND; Temperature Coefficient: X5R; Thickness (Max): 0.022" (0.55mm); Tolerance: ±10%; Voltage - Rated: 6.3V
R?#142 R?#143 = RES_10K_1/16W_1%_0402: as R?#131 on sheet p10_HDMI; Supplier 1: Digi-Key; Supplier Part Number 1: RHM10KJDKR-ND; RoHS: RoHS Compliant; Category: Resistors; Stock 1: 110842; Pricing 1: 1=0.1, 10=0.019, 25=0.014, 100=0.0078, 250=0.00596, 500=0.00476, 1000=0.0035, 5000=0.00251 (USD); Resistance (Ohms): 10k; Composition: Thick Film; Features: Automotive AEC-Q200 Qualified; Tolerance: ±5%; Package / Case: 0402 (1005 Metric); Supplier Device Package: 0402 (1005 Metric); Size / Dimension: 0.039" L x 0.020" W (1.00mm x 0.50mm); Height: 0.016" (0.40mm); Number of Terminations: 2; Packaging: Digi-Reel®; ComponentLink1URL: http://rohmfs.rohm.com/en/products/databook/datasheet/passive/resistor/chip_resistor/mcr_a.pdf; ComponentLink1Description: http://rohmfs.rohm.com/en/products/databook/datasheet/passive/resistor/chip_resistor/mcr_a.pdf
U?#22 = RAK310_A: RAK310 802.11bgn 2.4GHz SDIO WIFI; Manufacturer: RAK Wireless; Category: Integrated Circuits (ICs); Features: 802.11bgn, 2.4GHz; Manufacturer Part Number: RAK310

## Nets that join several sheets
+SYS_5V: p02_power_management (14 pins), p06_led_config_button (P?#7.7 P?#7.8), p10_HDMI (RT?.1)
+VDD_1V8: p02_power_management (C?#10.2 R?#5.2 U?#1.40), p10_HDMI (FB?#8.2)
+VDD_3V3A: p02_power_management (5 pins), p06_led_config_button (16 pins), p13_SD (C?#155.1 R?#141.2 U?#21.4)
+VDD_3V3AUX: p02_power_management (C?#14.1 D?#1.2 U?#1.1 U?#2.1), p14_WiFi_RAK310 (5 pins)
+VDD_3V3B: p02_power_management (C?#17.2 R?#10.2 U?#2.3), p04_cpu_2_of_3_usb_serial (U?#9.3 U?#9.8 U?#9.25 U?#9.26), p06_led_config_button (P?#7.3 P?#7.4), p09_ethernet (7 pins), p10_HDMI (R?#130.2), p13_SD (10 pins)
+VDD_5V: p02_power_management (C?#1.1 P?#1.1 U?#1.10), p06_led_config_button (P?#7.5 P?#7.6)
DDR_VREF: p03_cpu_1_of_3_jtag (C?#25.1 U?#3.J4), p07_ddr3_memory (6 pins)
DGND: p02_power_management (29 pins), p03_cpu_1_of_3_jtag (20 pins), p04_cpu_2_of_3_usb_serial (33 pins), p05_cpu_3_of_3 (111 pins), p06_led_config_button (24 pins), p07_ddr3_memory (26 pins), p08_eMMC (15 pins), p09_ethernet (25 pins), p10_HDMI (47 pins), p13_SD (6 pins), p14_WiFi_RAK310 (15 pins)
GND_EARTH: p02_power_management (MTG?#1.1 MTG?#2.1 MTG?#3.1 MTG?#4.1), p04_cpu_2_of_3_usb_serial (6 pins), p09_ethernet (P?#8.13 P?#8.14 R?#116.1), p10_HDMI (P?#9.20 P?#9.21 P?#9.22 P?#9.23), p13_SD (P?#10.12 P?#10.13)
GNDA_ADC: p04_cpu_2_of_3_usb_serial (C?#29.2 C?#30.2 C?#31.2 U?#6.A9), p05_cpu_3_of_3 (C?#94.2 FB?#6.1 U?#15.E8), p06_led_config_button (P?#7.34)
VDD_3V3A: p03_cpu_1_of_3_jtag (9 pins), p04_cpu_2_of_3_usb_serial (R?#41.1), p05_cpu_3_of_3 (42 pins)
VDD_3V3B: p03_cpu_1_of_3_jtag (C?#28.1 P?#2.5 R?#23.1 R?#24.1), p04_cpu_2_of_3_usb_serial (C?#32.2 R?#26.2 U?#7.7 U?#7.8), p08_eMMC (25 pins), p10_HDMI (R?#132.1)
VDD_ADC: p04_cpu_2_of_3_usb_serial (R?#29.2), p05_cpu_3_of_3 (C?#94.1 FB?#5.1 U?#15.D8)
VDDS_DDR: p05_cpu_3_of_3 (16 pins), p07_ddr3_memory (20 pins)
VRTC: p04_cpu_2_of_3_usb_serial (R?#27.2), p05_cpu_3_of_3 (C?#107.1 U?#15.D7)
12MHZ: p03_cpu_1_of_3_jtag (R?#17.2), p10_HDMI (U?#19.27)
AIN0: p04_cpu_2_of_3_usb_serial (U?#6.B6), p06_led_config_button (P?#7.39)
AIN1: p04_cpu_2_of_3_usb_serial (U?#6.C7), p06_led_config_button (P?#7.40)
AIN2: p04_cpu_2_of_3_usb_serial (U?#6.B7), p06_led_config_button (P?#7.37)
AIN3: p04_cpu_2_of_3_usb_serial (U?#6.A7), p06_led_config_button (P?#7.38)
AIN4: p04_cpu_2_of_3_usb_serial (U?#6.C8), p06_led_config_button (P?#7.33)
AIN5: p04_cpu_2_of_3_usb_serial (U?#6.B8), p06_led_config_button (P?#7.36)
AIN6: p04_cpu_2_of_3_usb_serial (U?#6.A8), p06_led_config_button (P?#7.35)
CLKOUT2: p03_cpu_1_of_3_jtag (P?#2.18 R?#15.2 R?#16.1), p06_led_config_button (P?#7.41)
DDR_A0: p03_cpu_1_of_3_jtag (U?#3.F3), p07_ddr3_memory (U?#16.N3)
DDR_A1: p03_cpu_1_of_3_jtag (U?#3.H1), p07_ddr3_memory (U?#16.P7)
DDR_A2: p03_cpu_1_of_3_jtag (U?#3.E4), p07_ddr3_memory (U?#16.P3)
DDR_A3: p03_cpu_1_of_3_jtag (U?#3.C3), p07_ddr3_memory (U?#16.N2)
DDR_A4: p03_cpu_1_of_3_jtag (U?#3.C2), p07_ddr3_memory (U?#16.P8)
DDR_A5: p03_cpu_1_of_3_jtag (U?#3.B1), p07_ddr3_memory (U?#16.P2)
DDR_A6: p03_cpu_1_of_3_jtag (U?#3.D5), p07_ddr3_memory (U?#16.R8)
DDR_A7: p03_cpu_1_of_3_jtag (U?#3.E2), p07_ddr3_memory (U?#16.R2)
DDR_A8: p03_cpu_1_of_3_jtag (U?#3.D4), p07_ddr3_memory (U?#16.T8)
DDR_A9: p03_cpu_1_of_3_jtag (U?#3.C1), p07_ddr3_memory (U?#16.R3)
DDR_A10: p03_cpu_1_of_3_jtag (U?#3.F4), p07_ddr3_memory (U?#16.L7)
DDR_A11: p03_cpu_1_of_3_jtag (U?#3.F2), p07_ddr3_memory (U?#16.R7)
DDR_A12: p03_cpu_1_of_3_jtag (U?#3.E3), p07_ddr3_memory (U?#16.N7)
DDR_A13: p03_cpu_1_of_3_jtag (U?#3.H3), p07_ddr3_memory (U?#16.T3)
DDR_A14: p03_cpu_1_of_3_jtag (U?#3.H4), p07_ddr3_memory (U?#16.T7)
DDR_A15: p03_cpu_1_of_3_jtag (U?#3.D3), p07_ddr3_memory (U?#16.M7)
DDR_BA0: p03_cpu_1_of_3_jtag (U?#3.C4), p07_ddr3_memory (U?#16.M2)
DDR_BA1: p03_cpu_1_of_3_jtag (U?#3.E1), p07_ddr3_memory (U?#16.N8)
DDR_BA2: p03_cpu_1_of_3_jtag (U?#3.B3), p07_ddr3_memory (U?#16.M3)
DDR_CASn: p03_cpu_1_of_3_jtag (U?#3.F1), p07_ddr3_memory (U?#16.K3)
DDR_CKE: p03_cpu_1_of_3_jtag (U?#3.G3), p07_ddr3_memory (R?#78.2 U?#16.K9)
DDR_CLK: p03_cpu_1_of_3_jtag (U?#3.D2), p07_ddr3_memory (U?#16.J7)
DDR_CLKn: p03_cpu_1_of_3_jtag (U?#3.D1), p07_ddr3_memory (U?#16.K7)
DDR_CSn: p03_cpu_1_of_3_jtag (U?#3.H2), p07_ddr3_memory (U?#16.L2)
DDR_D0: p03_cpu_1_of_3_jtag (U?#3.M3), p07_ddr3_memory (U?#16.E3)
DDR_D1: p03_cpu_1_of_3_jtag (U?#3.M4), p07_ddr3_memory (U?#16.F7)
DDR_D2: p03_cpu_1_of_3_jtag (U?#3.N1), p07_ddr3_memory (U?#16.F2)
DDR_D3: p03_cpu_1_of_3_jtag (U?#3.N2), p07_ddr3_memory (U?#16.F8)
DDR_D4: p03_cpu_1_of_3_jtag (U?#3.N3), p07_ddr3_memory (U?#16.H3)
DDR_D5: p03_cpu_1_of_3_jtag (U?#3.N4), p07_ddr3_memory (U?#16.H8)
DDR_D6: p03_cpu_1_of_3_jtag (U?#3.P3), p07_ddr3_memory (U?#16.G2)
DDR_D7: p03_cpu_1_of_3_jtag (U?#3.P4), p07_ddr3_memory (U?#16.H7)
DDR_D8: p03_cpu_1_of_3_jtag (U?#3.J1), p07_ddr3_memory (U?#16.D7)
DDR_D9: p03_cpu_1_of_3_jtag (U?#3.K1), p07_ddr3_memory (U?#16.C3)
DDR_D10: p03_cpu_1_of_3_jtag (U?#3.K2), p07_ddr3_memory (U?#16.C8)
DDR_D11: p03_cpu_1_of_3_jtag (U?#3.K3), p07_ddr3_memory (U?#16.C2)
DDR_D12: p03_cpu_1_of_3_jtag (U?#3.K4), p07_ddr3_memory (U?#16.A7)
DDR_D13: p03_cpu_1_of_3_jtag (U?#3.L3), p07_ddr3_memory (U?#16.A2)
DDR_D14: p03_cpu_1_of_3_jtag (U?#3.L4), p07_ddr3_memory (U?#16.B8)
DDR_D15: p03_cpu_1_of_3_jtag (U?#3.M1), p07_ddr3_memory (U?#16.A3)
DDR_DQM0: p03_cpu_1_of_3_jtag (U?#3.M2), p07_ddr3_memory (U?#16.E7)
DDR_DQM1: p03_cpu_1_of_3_jtag (U?#3.J2), p07_ddr3_memory (U?#16.D3)
DDR_DQS0: p03_cpu_1_of_3_jtag (U?#3.P1), p07_ddr3_memory (U?#16.F3)
DDR_DQS1: p03_cpu_1_of_3_jtag (U?#3.L1), p07_ddr3_memory (U?#16.C7)
DDR_DQSN0: p03_cpu_1_of_3_jtag (U?#3.P2), p07_ddr3_memory (U?#16.G3)
DDR_DQSN1: p03_cpu_1_of_3_jtag (U?#3.L2), p07_ddr3_memory (U?#16.B7)
DDR_ODT: p03_cpu_1_of_3_jtag (U?#3.G1), p07_ddr3_memory (U?#16.K1)
DDR_RASn: p03_cpu_1_of_3_jtag (U?#3.G4), p07_ddr3_memory (U?#16.J3)
DDR_RESETn: p03_cpu_1_of_3_jtag (U?#3.G2), p07_ddr3_memory (R?#79.2 U?#16.T2)
DDR_WEn: p03_cpu_1_of_3_jtag (U?#3.B2), p07_ddr3_memory (U?#16.L3)
EHRPWM1A: p03_cpu_1_of_3_jtag (U?#3.U14 U?#3.V7), p06_led_config_button (P?#6.24 P?#7.14), p08_eMMC (R?#84.2 U?#17.A4)
EHRPWM1B: p03_cpu_1_of_3_jtag (U?#3.R8 U?#3.T14), p06_led_config_button (P?#6.5 P?#7.16), p08_eMMC (R?#85.2 U?#17.A5)
EHRPWM2A: p03_cpu_1_of_3_jtag (U?#3.U10), p06_led_config_button (P?#6.19)
EHRPWM2B: p03_cpu_1_of_3_jtag (U?#3.T10), p06_led_config_button (P?#6.13)
eMMC_RSTn: p03_cpu_1_of_3_jtag (R?#22.2), p08_eMMC (R?#93.2 U?#17.K5)
GPIO0_7: p04_cpu_2_of_3_usb_serial (R?#38.1 R?#39.1), p06_led_config_button (P?#7.42)
GPIO0_26: p03_cpu_1_of_3_jtag (U?#3.T11 U?#3.T16), p06_led_config_button (P?#6.14)
GPIO0_27: p03_cpu_1_of_3_jtag (U?#3.U12), p06_led_config_button (P?#6.17)
GPIO1_12: p03_cpu_1_of_3_jtag (U?#3.T12), p06_led_config_button (P?#6.12)
GPIO1_13: p03_cpu_1_of_3_jtag (U?#3.R12), p06_led_config_button (P?#6.11)
GPIO1_14: p03_cpu_1_of_3_jtag (U?#3.V13), p06_led_config_button (P?#6.16)
GPIO1_15: p03_cpu_1_of_3_jtag (U?#3.U13), p06_led_config_button (P?#6.15)
GPIO1_16: p03_cpu_1_of_3_jtag (R?#18.2 R?#19.2), p06_led_config_button (P?#7.15)
GPIO1_17: p03_cpu_1_of_3_jtag (U?#3.V14), p06_led_config_button (P?#7.23)
GPIO1_28: p03_cpu_1_of_3_jtag (U?#3.U18), p06_led_config_button (P?#7.12)
GPIO1_29: p03_cpu_1_of_3_jtag (U?#3.V6), p06_led_config_button (P?#6.26)
GPIO3_19: p04_cpu_2_of_3_usb_serial (U?#6.C13), p06_led_config_button (P?#7.27)
GPIO3_20: p03_cpu_1_of_3_jtag (R?#16.2), p04_cpu_2_of_3_usb_serial (U?#6.D13)
GPIO3_21: p03_cpu_1_of_3_jtag (R?#20.2), p04_cpu_2_of_3_usb_serial (U?#6.A14), p06_led_config_button (P?#7.25)
I2C0_SCL: p02_power_management (R?#2.2 U?#1.28), p04_cpu_2_of_3_usb_serial (U?#6.C17), p10_HDMI (U?#19.52), p13_SD (U?#21.1)
I2C0_SCL: p02_power_management (R?#3.2 U?#1.27), p04_cpu_2_of_3_usb_serial (U?#6.C16), p10_HDMI (U?#19.51), p13_SD (U?#21.3)
I2C1_SCL: p04_cpu_2_of_3_usb_serial (U?#6.A16), p06_led_config_button (P?#7.17)
I2C1_SDA: p04_cpu_2_of_3_usb_serial (U?#6.B16), p06_led_config_button (P?#7.18)
I2C2_SCL: p04_cpu_2_of_3_usb_serial (U?#6.D17), p06_led_config_button (P?#7.19)
I2C2_SDA: p04_cpu_2_of_3_usb_serial (U?#6.D18), p06_led_config_button (P?#7.20)
LCD_DATA0: p04_cpu_2_of_3_usb_serial (U?#6.R1), p06_led_config_button (P?#6.45 R?#61.2 R?#77.1), p10_HDMI (C?#152.1 U?#19.15)
LCD_DATA1: p04_cpu_2_of_3_usb_serial (U?#6.R2), p06_led_config_button (P?#6.46 R?#60.2 R?#76.1), p10_HDMI (C?#151.1 U?#19.13)
LCD_DATA2: p04_cpu_2_of_3_usb_serial (U?#6.R3), p06_led_config_button (P?#6.43 R?#59.2 R?#75.1), p10_HDMI (C?#150.1 U?#19.12)
LCD_DATA3: p04_cpu_2_of_3_usb_serial (U?#6.R4), p06_led_config_button (P?#6.44 R?#58.2 R?#74.1), p10_HDMI (C?#149.1 U?#19.11)
LCD_DATA4: p04_cpu_2_of_3_usb_serial (U?#6.T1), p06_led_config_button (P?#6.41 R?#57.2 R?#73.1), p10_HDMI (C?#148.1 U?#19.10)
LCD_DATA5: p04_cpu_2_of_3_usb_serial (U?#6.T2), p06_led_config_button (P?#6.42 R?#56.2 R?#72.1), p10_HDMI (C?#142.1 U?#19.7)
LCD_DATA6: p04_cpu_2_of_3_usb_serial (U?#6.T3), p06_led_config_button (P?#6.39 R?#55.2 R?#71.1), p10_HDMI (C?#141.1 U?#19.6)
LCD_DATA7: p04_cpu_2_of_3_usb_serial (U?#6.T4), p06_led_config_button (P?#6.40 R?#54.2 R?#70.1), p10_HDMI (C?#140.1 U?#19.3)
LCD_DATA8: p04_cpu_2_of_3_usb_serial (U?#6.U1), p06_led_config_button (P?#6.37 R?#53.2 R?#69.1), p10_HDMI (C?#139.1 U?#19.2)
LCD_DATA9: p04_cpu_2_of_3_usb_serial (U?#6.U2), p06_led_config_button (P?#6.38 R?#52.2 R?#68.1), p10_HDMI (C?#138.1 U?#19.1)
LCD_DATA10: p04_cpu_2_of_3_usb_serial (U?#6.U3), p06_led_config_button (P?#6.36 R?#51.2 R?#67.1), p10_HDMI (C?#137.1 U?#19.64)
LCD_DATA11: p04_cpu_2_of_3_usb_serial (U?#6.U4), p06_led_config_button (P?#6.34 R?#50.2 R?#66.1), p10_HDMI (C?#147.1 U?#19.60)
LCD_DATA12: p04_cpu_2_of_3_usb_serial (U?#6.V2), p06_led_config_button (P?#6.35 R?#49.2 R?#65.1), p10_HDMI (C?#146.1 U?#19.59)
LCD_DATA13: p04_cpu_2_of_3_usb_serial (U?#6.V3), p06_led_config_button (P?#6.33 R?#48.2 R?#64.1), p10_HDMI (C?#145.1 U?#19.58)
LCD_DATA14: p04_cpu_2_of_3_usb_serial (U?#6.V4), p06_led_config_button (P?#6.31 R?#47.2 R?#63.1), p10_HDMI (C?#144.1 U?#19.57)
LCD_DATA15: p04_cpu_2_of_3_usb_serial (U?#6.T5), p06_led_config_button (P?#6.32 R?#46.2 R?#62.1), p10_HDMI (C?#143.1 U?#19.56)
LCD_DE: p04_cpu_2_of_3_usb_serial (R?#36.2), p06_led_config_button (P?#6.30), p10_HDMI (U?#19.20)
LCD_HSYNC: p04_cpu_2_of_3_usb_serial (R?#34.2), p06_led_config_button (P?#6.29), p10_HDMI (U?#19.22)
LCD_PCLK: p04_cpu_2_of_3_usb_serial (R?#32.2), p06_led_config_button (P?#6.28), p10_HDMI (U?#19.4)
LCD_VSYNC: p04_cpu_2_of_3_usb_serial (R?#33.2), p06_led_config_button (P?#6.27), p10_HDMI (U?#19.21)
LDO_PGOOD: p02_power_management (U?#1.46), p03_cpu_1_of_3_jtag (U?#3.B5)
MDIO_CLK: p04_cpu_2_of_3_usb_serial (U?#6.M18), p09_ethernet (U?#18.17)
MDIO_DATA: p04_cpu_2_of_3_usb_serial (U?#6.M17), p09_ethernet (R?#105.2 U?#18.16)
MII1_COL: p04_cpu_2_of_3_usb_serial (U?#6.H16), p09_ethernet (R?#120.1)
MII1_CRS_DV: p04_cpu_2_of_3_usb_serial (U?#6.H17), p09_ethernet (R?#121.1)
MII1_REFCLK: p04_cpu_2_of_3_usb_serial (R?#30.2), p09_ethernet (R?#106.1 R?#122.1)
MII1_RXCLK: p04_cpu_2_of_3_usb_serial (U?#6.L18), p09_ethernet (R?#113.1)
MII1_RXD0: p04_cpu_2_of_3_usb_serial (U?#6.M16), p09_ethernet (R?#110.1)
MII1_RXD1: p04_cpu_2_of_3_usb_serial (U?#6.L15), p09_ethernet (R?#109.1)
MII1_RXD2: p04_cpu_2_of_3_usb_serial (U?#6.L16), p09_ethernet (R?#108.1)
MII1_RXD3: p04_cpu_2_of_3_usb_serial (U?#6.L17), p09_ethernet (R?#107.1)
MII1_RXDV: p04_cpu_2_of_3_usb_serial (U?#6.J17), p09_ethernet (R?#111.1)
MII1_RXERR: p04_cpu_2_of_3_usb_serial (U?#6.J15), p09_ethernet (R?#114.1)
MII1_TXCLK: p04_cpu_2_of_3_usb_serial (U?#6.K18), p09_ethernet (R?#117.1)
MII1_TXD0: p04_cpu_2_of_3_usb_serial (U?#6.K17), p09_ethernet (U?#18.22)
MII1_TXD1: p04_cpu_2_of_3_usb_serial (U?#6.K16), p09_ethernet (U?#18.23)
MII1_TXD2: p04_cpu_2_of_3_usb_serial (U?#6.K15), p09_ethernet (U?#18.24)
MII1_TXD3: p04_cpu_2_of_3_usb_serial (U?#6.J18), p09_ethernet (U?#18.25)
MII1_TXEN: p04_cpu_2_of_3_usb_serial (U?#6.J16), p09_ethernet (U?#18.21)
MMC0_CD: p03_cpu_1_of_3_jtag (P?#2.19), p04_cpu_2_of_3_usb_serial (U?#6.C15), p13_SD (P?#10.10 R?#140.2)
MMC0_CLKO: p03_cpu_1_of_3_jtag (U?#3.G17), p13_SD (P?#10.5 R?#139.2)
MMC0_CMD: p03_cpu_1_of_3_jtag (U?#3.G18), p13_SD (P?#10.2 R?#138.2)
MMC0_DAT0: p03_cpu_1_of_3_jtag (U?#3.G16), p13_SD (P?#10.7 R?#134.2)
MMC0_DAT1: p03_cpu_1_of_3_jtag (U?#3.G15), p13_SD (P?#10.8 R?#135.2)
MMC0_DAT2: p03_cpu_1_of_3_jtag (U?#3.F18), p13_SD (P?#10.9 R?#136.2)
MMC0_DAT3: p03_cpu_1_of_3_jtag (U?#3.F17), p13_SD (P?#10.1 R?#137.2)
MMC1_CLK: p03_cpu_1_of_3_jtag (U?#3.U9), p06_led_config_button (P?#6.21), p08_eMMC (R?#92.2 U?#17.M6)
MMC1_CMD: p03_cpu_1_of_3_jtag (U?#3.V9), p06_led_config_button (P?#6.20), p08_eMMC (R?#91.2 U?#17.M5)
MMC1_DAT0: p03_cpu_1_of_3_jtag (U?#3.U7), p06_led_config_button (P?#6.25), p08_eMMC (R?#83.2 U?#17.A3)
MMC1_DAT3: p03_cpu_1_of_3_jtag (U?#3.T8), p06_led_config_button (P?#6.6), p08_eMMC (R?#86.2 U?#17.B2)
MMC1_DAT4: p03_cpu_1_of_3_jtag (U?#3.U8), p06_led_config_button (P?#6.23), p08_eMMC (R?#87.2 U?#17.B3)
MMC1_DAT5: p03_cpu_1_of_3_jtag (U?#3.V8), p06_led_config_button (P?#6.22), p08_eMMC (R?#88.2 U?#17.B4)
MMC1_DAT6: p03_cpu_1_of_3_jtag (U?#3.R9), p06_led_config_button (P?#6.3), p08_eMMC (R?#89.2 U?#17.B5)
MMC1_DAT7: p03_cpu_1_of_3_jtag (U?#3.T9), p06_led_config_button (P?#6.4), p08_eMMC (R?#90.2 U?#17.B6)
PMIC_INT: p02_power_management (R?#1.2 U?#1.45), p03_cpu_1_of_3_jtag (U?#3.B18)
PMIC_POWR_EN: p02_power_management (U?#1.9), p04_cpu_2_of_3_usb_serial (U?#6.C6)
PWR_BUT: p02_power_management (S?#1.2 S?#1.4 U?#1.25), p06_led_config_button (P?#7.9)
SPI1_CS0: p04_cpu_2_of_3_usb_serial (U?#6.C12), p06_led_config_button (P?#7.28), p10_HDMI (U?#19.25)
SPI1_D0: p04_cpu_2_of_3_usb_serial (U?#6.B13), p06_led_config_button (P?#7.29), p10_HDMI (U?#19.24)
SPI1_D1: p04_cpu_2_of_3_usb_serial (U?#6.D12), p06_led_config_button (P?#7.30)
SPI1_SCLK: p04_cpu_2_of_3_usb_serial (U?#6.A13), p06_led_config_button (P?#7.31), p10_HDMI (U?#19.23)
SYS_RESETn: p03_cpu_1_of_3_jtag (7 pins), p06_led_config_button (P?#7.10), p09_ethernet (U?#18.19)
TIMER4: p03_cpu_1_of_3_jtag (U?#3.R7), p06_led_config_button (P?#6.7)
TIMER5: p03_cpu_1_of_3_jtag (U?#3.T6), p06_led_config_button (P?#6.9)
TIMER6: p03_cpu_1_of_3_jtag (U?#3.U6), p06_led_config_button (P?#6.10)
TIMER7: p03_cpu_1_of_3_jtag (U?#3.T7), p06_led_config_button (P?#6.8)
UART1_RXD: p04_cpu_2_of_3_usb_serial (U?#6.D16), p06_led_config_button (P?#7.26)
UART1_TXD: p04_cpu_2_of_3_usb_serial (U?#6.D15), p06_led_config_button (P?#7.24)
UART2_RXD: p04_cpu_2_of_3_usb_serial (U?#6.A17), p06_led_config_button (P?#7.22)
UART2_TXD: p04_cpu_2_of_3_usb_serial (U?#6.B17), p06_led_config_button (P?#7.21)
UART4_RXD: p03_cpu_1_of_3_jtag (U?#3.T17), p06_led_config_button (P?#7.11)
UART4_TXD: p03_cpu_1_of_3_jtag (U?#3.U17), p06_led_config_button (P?#7.13)
WAKEUP: p02_power_management (U?#1.13), p04_cpu_2_of_3_usb_serial (R?#27.1 U?#6.C5)

## Assembly variants
v0.10: not fitted C? C? C? C? R? R? R? R? R? R? R? R? R? R? R? R? R? R? R? R? R? R?